# EAGLE schematic 6matrix (EAGLE 9.3.1)

## Sheet 1 of 3
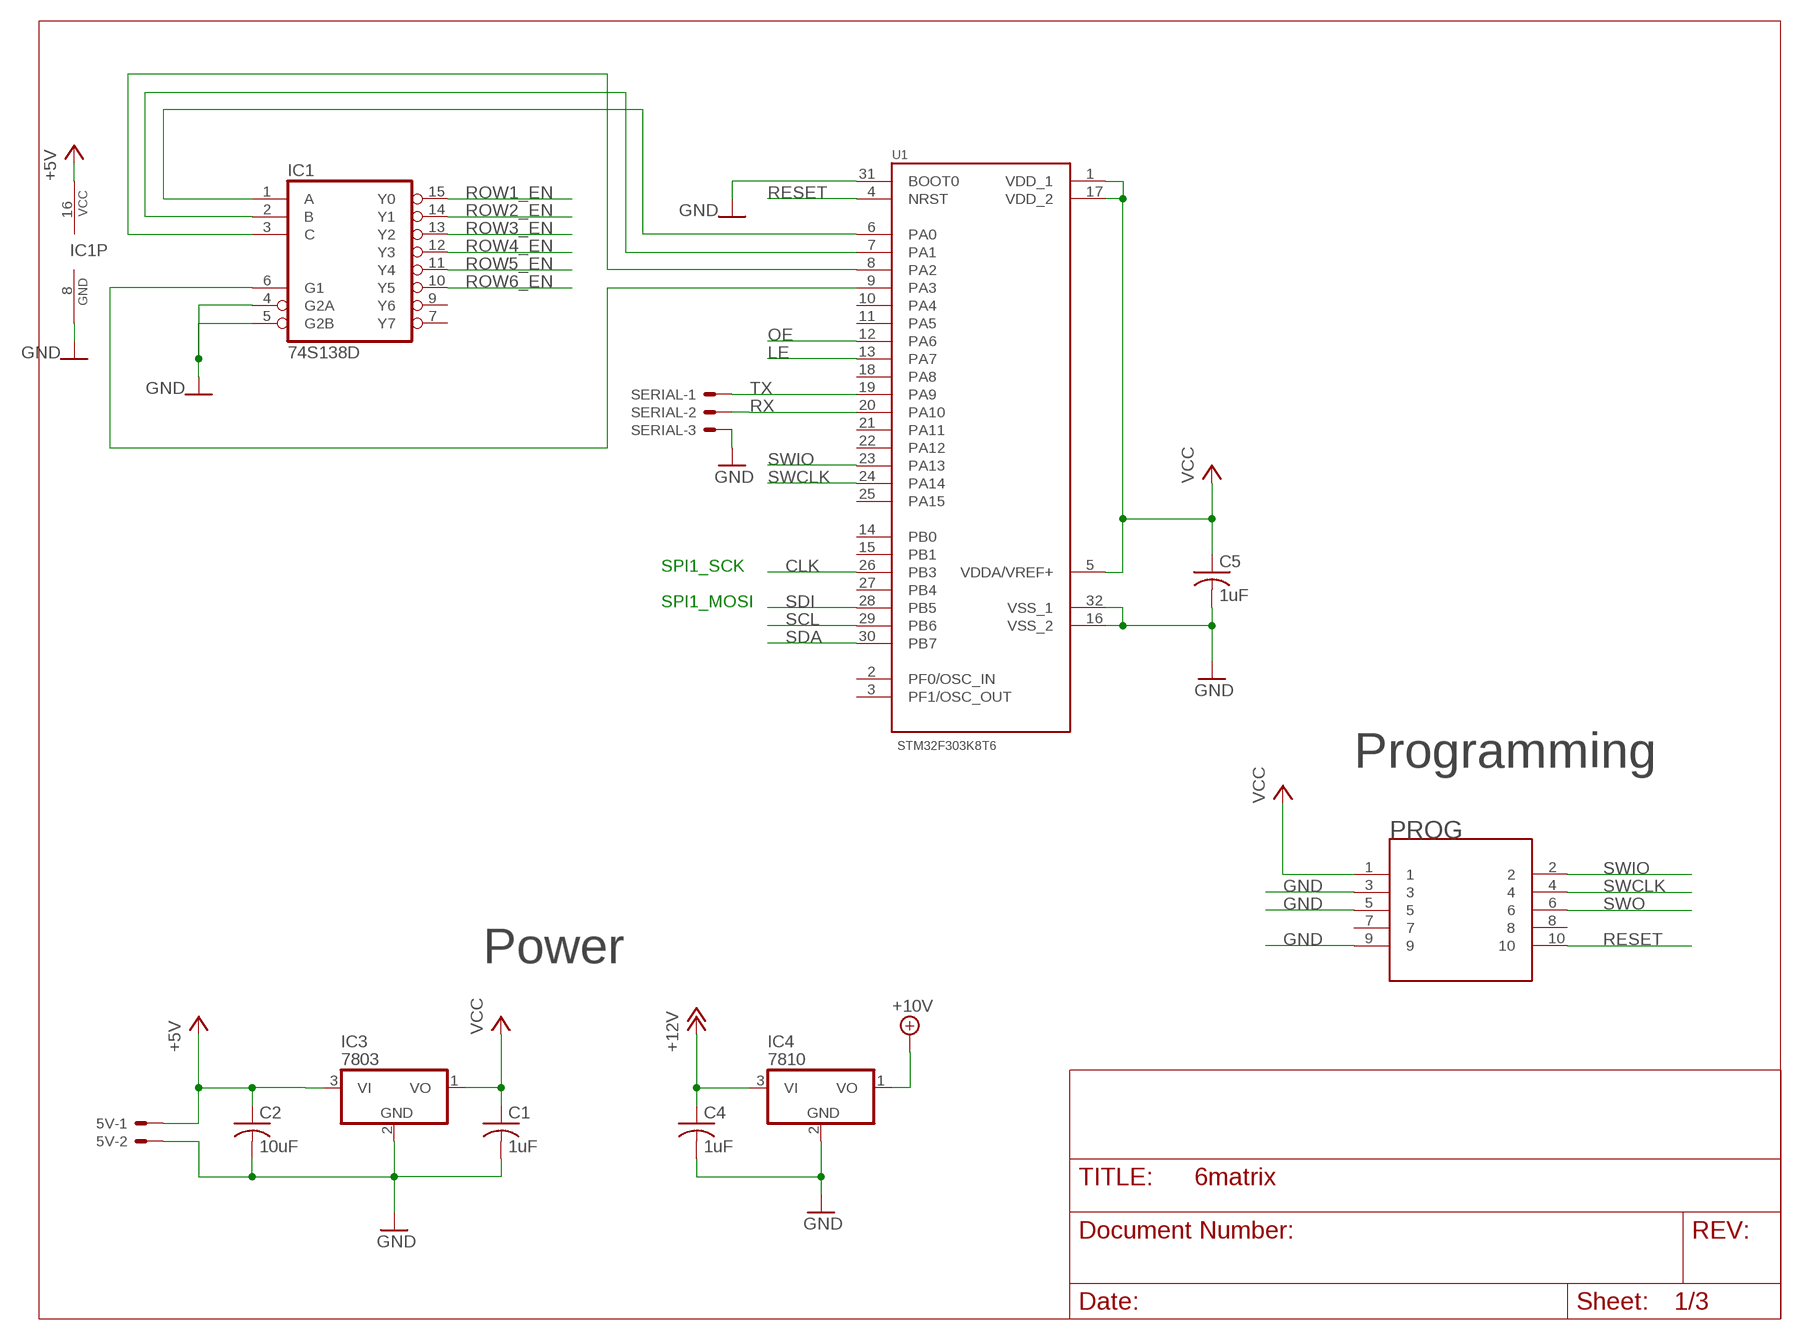
[diagram p0: schematic, sheet 1]

### Parts
5V  22-23-2021  [22-23-2021]
C1  1uF  C-US025-025X050  [C025-025X050]
C2  10uF  C-US025-025X050  [C025-025X050]
C4  1uF  C-US025-025X050  [C025-025X050]
C5  1uF  C-USC0805  [C0805]
IC1  74S138D  [SO16]
IC3  7803  78L05Z  [TO92]
IC4  7810  78L05Z  [TO92]
PROG  CORTEX_HEADERJ  [CORTEX_HEADER]
SERIAL  22-23-2031  [22-23-2031]
U1  STM32F303K8T6  [QFP80P900X900X160-32N]

### Nets
+5V [power]: 5V.1 C2.1 IC1.16(VCC) IC3.3(VI) ; also sheet 2
+10V [power]: IC4.1(VO) ; also sheet 3
+12V [power]: C4.1 IC4.3(VI) ; also sheet 3
CLK: U1.26(PB3) ; also sheet 2
GND [power]: 5V.2 C1.2 C2.2 C4.2 C5.2 IC1.4(G2A) IC1.5(G2B) IC1.8(GND) IC3.2(GND) IC4.2(GND) PROG.3 PROG.5 PROG.9 SERIAL.3 U1.16(VSS_2) U1.31(BOOT0) U1.32(VSS_1) ; also sheet 2,3
LE: U1.13(PA7) ; also sheet 2
N$7: IC1.1(A) U1.6(PA0)
N$10: IC1.2(B) U1.7(PA1)
N$12: IC1.3(C) U1.8(PA2)
N$14: IC1.6(G1) U1.9(PA3)
OE: U1.12(PA6) ; also sheet 2
RESET: PROG.10 U1.4(NRST)
ROW1_EN: IC1.15(Y0) ; also sheet 2
ROW2_EN: IC1.14(Y1) ; also sheet 2
ROW3_EN: IC1.13(Y2) ; also sheet 2
ROW4_EN: IC1.12(Y3) ; also sheet 2
ROW5_EN: IC1.11(Y4) ; also sheet 2
ROW6_EN: IC1.10(Y5) ; also sheet 2
RX: SERIAL.2 U1.20(PA10)
SCL: U1.29(PB6) ; also sheet 3
SDA: U1.30(PB7) ; also sheet 3
SDI: U1.28(PB5) ; also sheet 2
SWCLK: PROG.4 U1.24(PA14)
SWIO: PROG.2 U1.23(PA13)
SWO: PROG.6
TX: SERIAL.1 U1.19(PA9)
VCC [power]: C1.1 C5.1 IC3.1(VO) PROG.1 U1.1(VDD_1) U1.5(VDDA/VREF+) U1.17(VDD_2) ; also sheet 2,3
Unconnected: IC1.7(Y7) IC1.9(Y6) PROG.7 PROG.8 U1.2(PF0/OSC_IN) U1.3(PF1/OSC_OUT) U1.10(PA4) U1.11(PA5) U1.14(PB0) U1.15(PB1) U1.18(PA8) U1.21(PA11) U1.22(PA12) U1.25(PA15) U1.27(PB4)

### Notes on the sheet
- SPI1_SCK
- SPI1_MOSI
- Programming
- Power

## Sheet 2 of 3
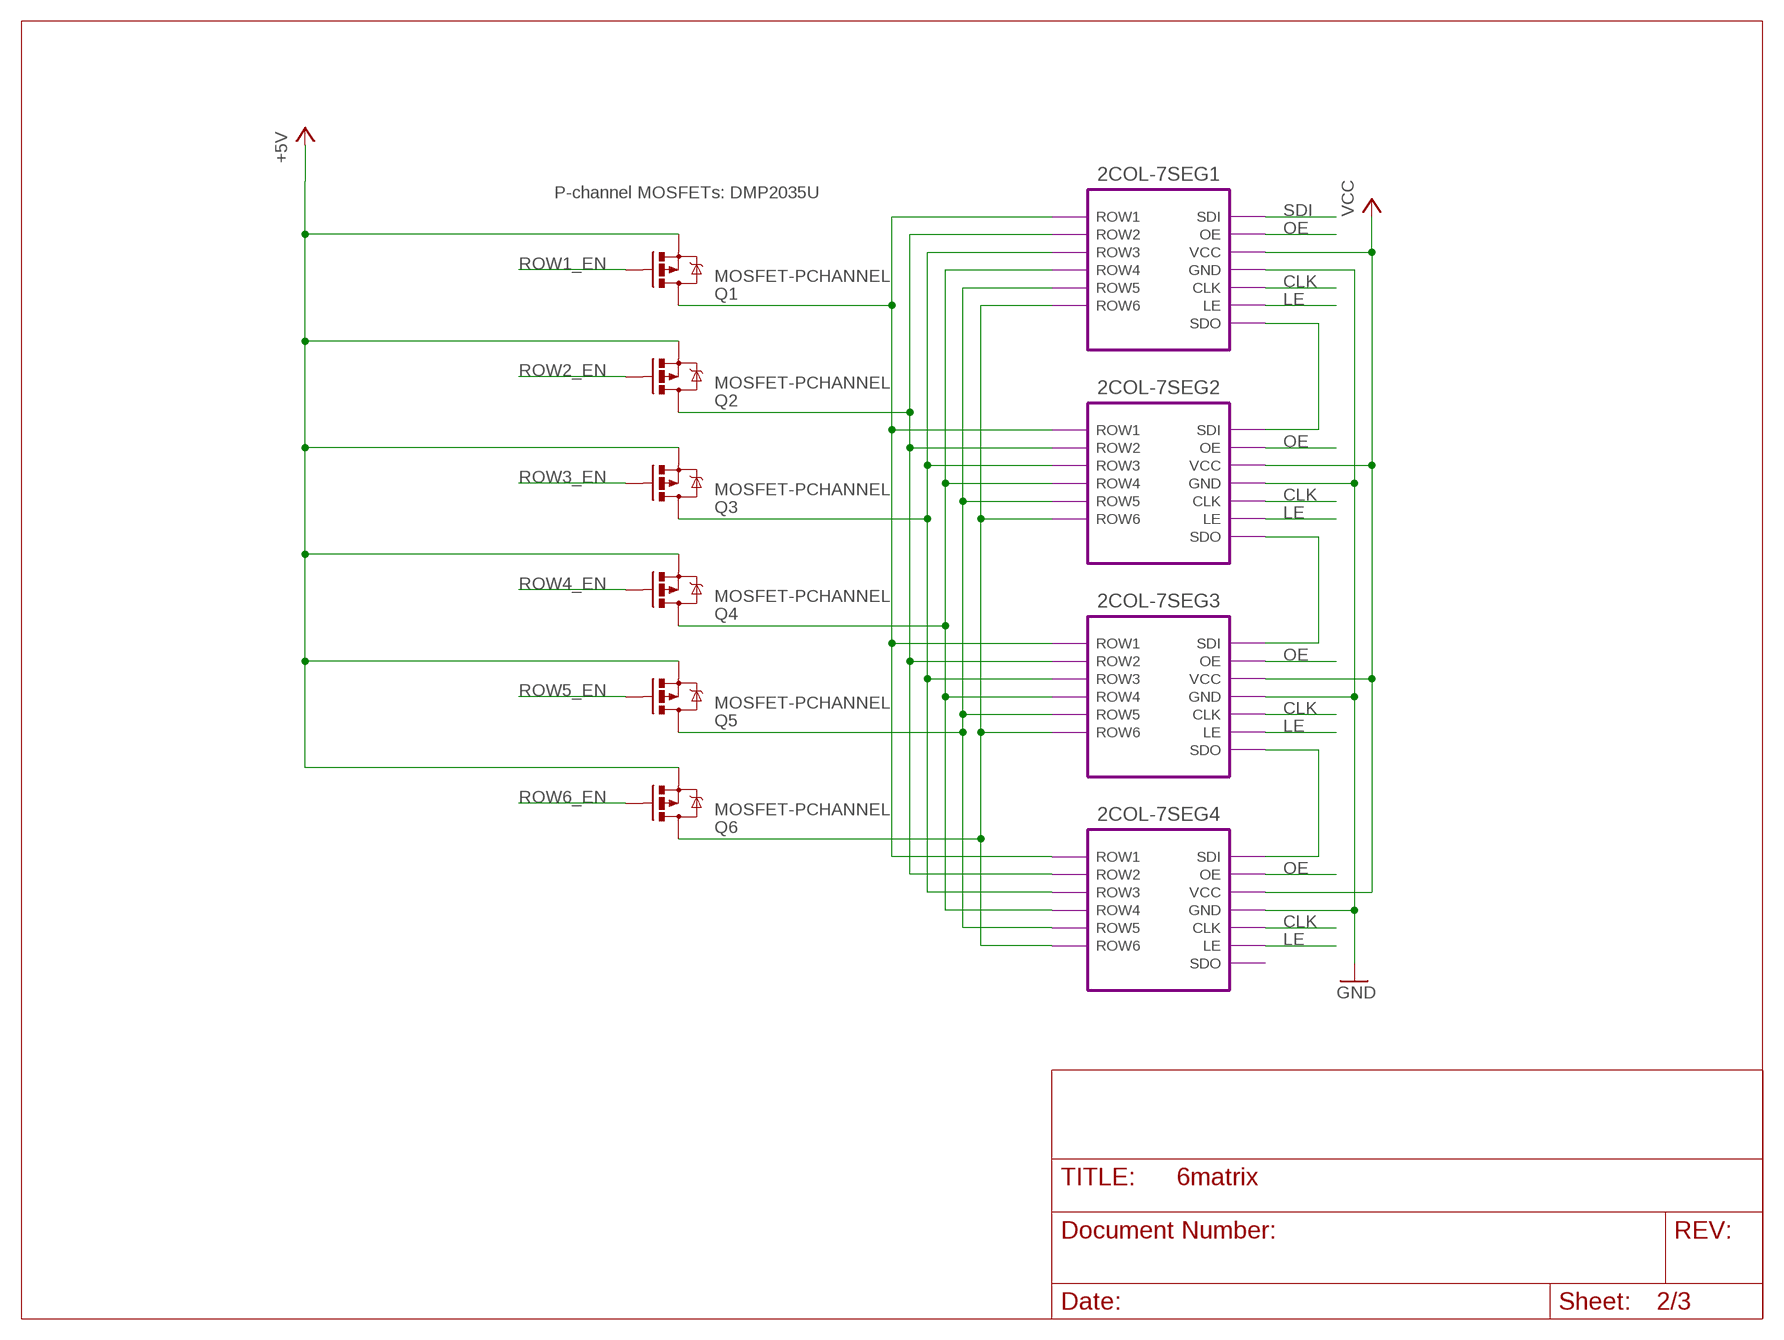
[diagram p1: schematic, sheet 2]

### Parts
Q1  MOSFET-PCHANNEL  [SOT23]
Q2  MOSFET-PCHANNEL  [SOT23]
Q3  MOSFET-PCHANNEL  [SOT23]
Q4  MOSFET-PCHANNEL  [SOT23]
Q5  MOSFET-PCHANNEL  [SOT23]
Q6  MOSFET-PCHANNEL  [SOT23]

### Module instances
2COL-7SEG1 = 2COL-7SEG
2COL-7SEG2 = 2COL-7SEG
2COL-7SEG3 = 2COL-7SEG
2COL-7SEG4 = 2COL-7SEG

### Nets
+5V [power]: Q1.2(S) Q2.2(S) Q3.2(S) Q4.2(S) Q5.2(S) Q6.2(S) ; also sheet 1
CLK: port 2COL-7SEG2.CLK 2COL-7SEG1.CLK 2COL-7SEG3.CLK 2COL-7SEG4.CLK ; also sheet 1
GND [power]: port 2COL-7SEG1.GND 2COL-7SEG4.GND 2COL-7SEG2.GND 2COL-7SEG3.GND ; also sheet 1,3
LE: port 2COL-7SEG4.LE 2COL-7SEG2.LE 2COL-7SEG1.LE 2COL-7SEG3.LE ; also sheet 1
N$1: Q6.3(D) ; port 2COL-7SEG4.ROW6 2COL-7SEG3.ROW6 2COL-7SEG2.ROW6 2COL-7SEG1.ROW6
N$2: Q5.3(D) ; port 2COL-7SEG4.ROW5 2COL-7SEG3.ROW5 2COL-7SEG2.ROW5 2COL-7SEG1.ROW5
N$3: Q4.3(D) ; port 2COL-7SEG4.ROW4 2COL-7SEG3.ROW4 2COL-7SEG2.ROW4 2COL-7SEG1.ROW4
N$4: Q3.3(D) ; port 2COL-7SEG4.ROW3 2COL-7SEG3.ROW3 2COL-7SEG2.ROW3 2COL-7SEG1.ROW3
N$5: Q2.3(D) ; port 2COL-7SEG4.ROW2 2COL-7SEG3.ROW2 2COL-7SEG2.ROW2 2COL-7SEG1.ROW2
N$6: Q1.3(D) ; port 2COL-7SEG4.ROW1 2COL-7SEG3.ROW1 2COL-7SEG2.ROW1 2COL-7SEG1.ROW1
N$8: port 2COL-7SEG1.SDO 2COL-7SEG2.SDI
N$9: port 2COL-7SEG2.SDO 2COL-7SEG3.SDI
N$11: port 2COL-7SEG3.SDO 2COL-7SEG4.SDI
OE: port 2COL-7SEG2.OE 2COL-7SEG1.OE 2COL-7SEG3.OE 2COL-7SEG4.OE ; also sheet 1
ROW1_EN: Q1.1(G) ; also sheet 1
ROW2_EN: Q2.1(G) ; also sheet 1
ROW3_EN: Q3.1(G) ; also sheet 1
ROW4_EN: Q4.1(G) ; also sheet 1
ROW5_EN: Q5.1(G) ; also sheet 1
ROW6_EN: Q6.1(G) ; also sheet 1
SDI: port 2COL-7SEG1.SDI ; also sheet 1
VCC [power]: port 2COL-7SEG1.VCC 2COL-7SEG4.VCC 2COL-7SEG2.VCC 2COL-7SEG3.VCC ; also sheet 1,3

### Notes on the sheet
- P-channel MOSFETs: DMP2035U

## Sheet 3 of 3
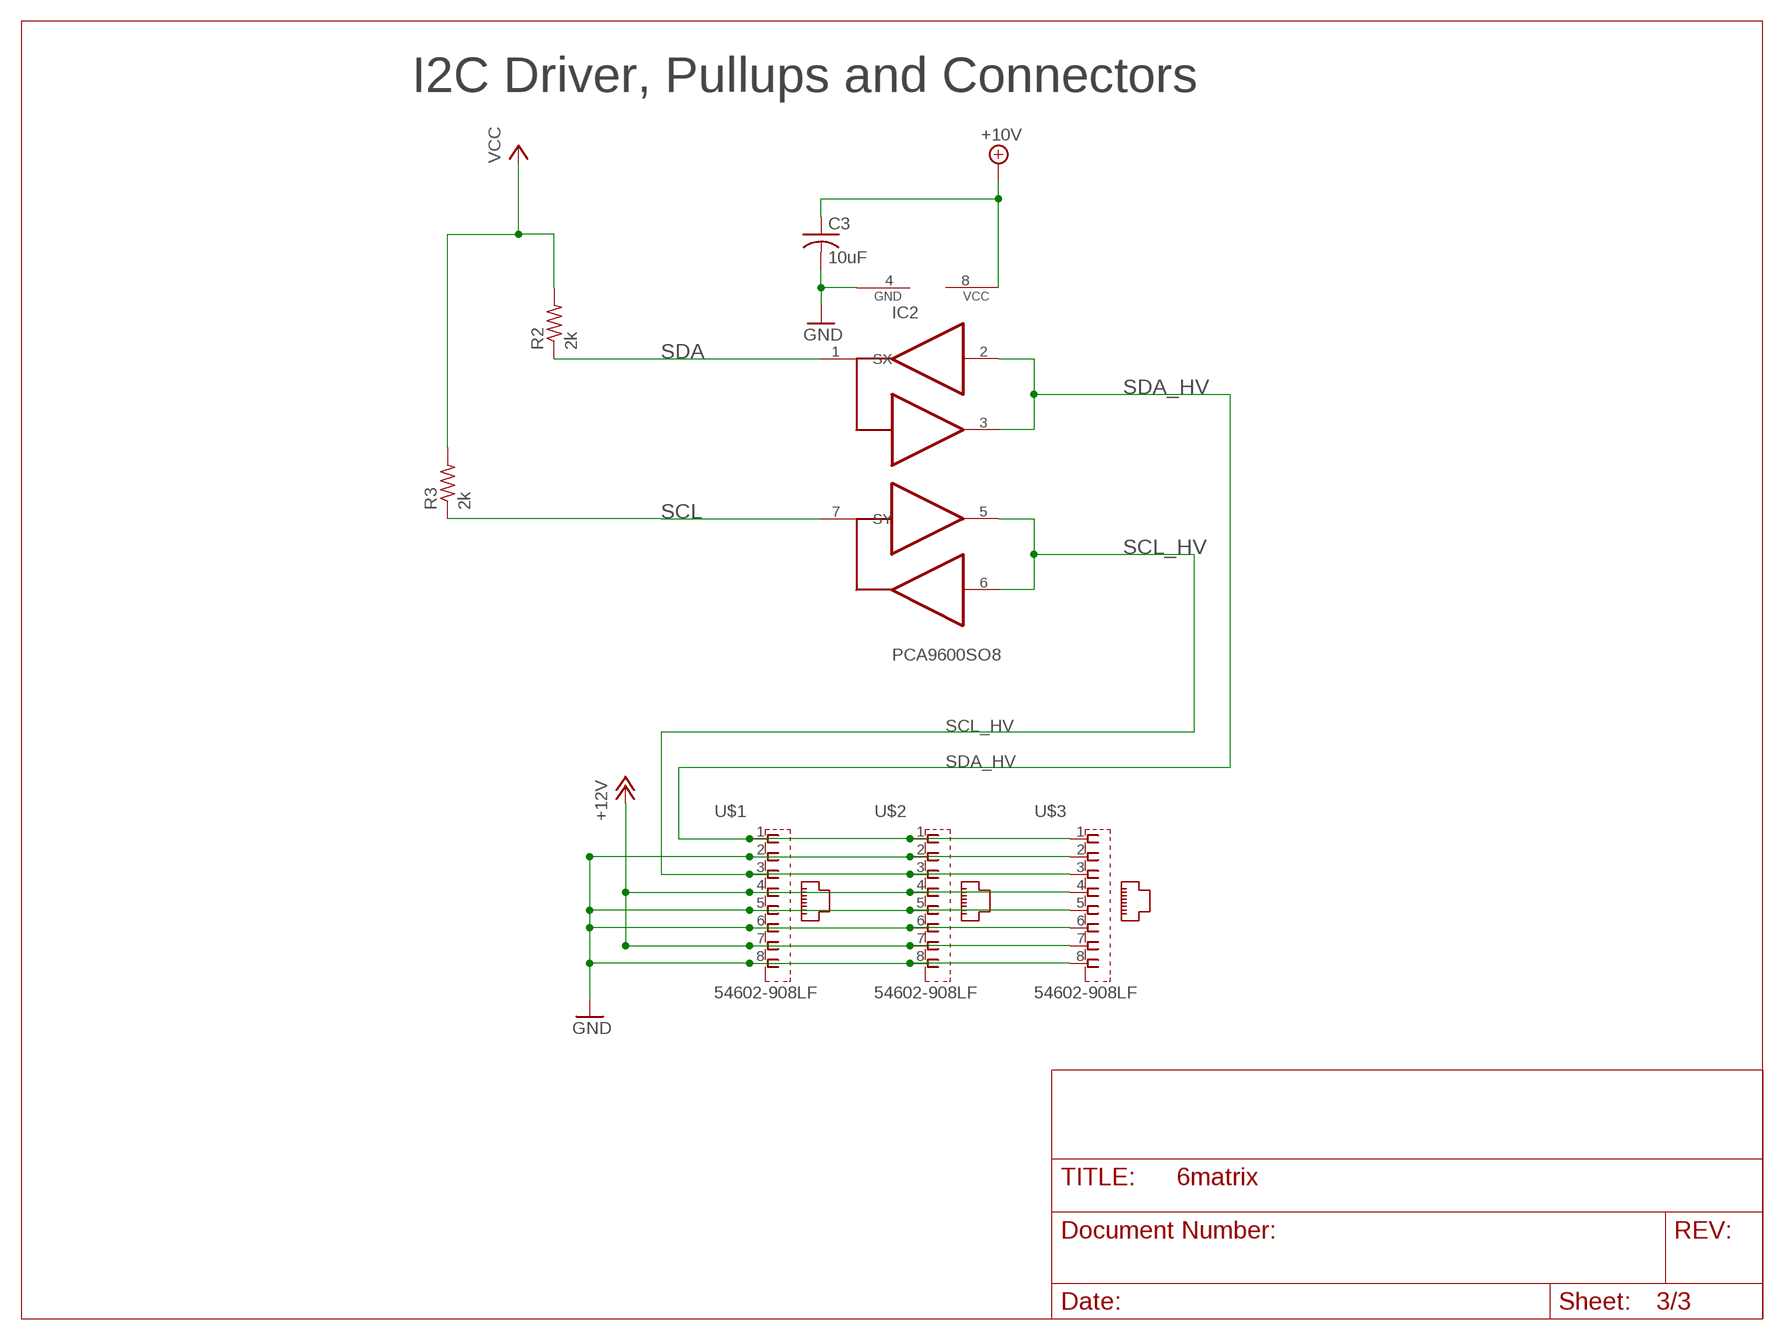
[diagram p2: schematic, sheet 3]

### Parts
C3  10uF  C-US025-025X050  [C025-025X050]
IC2  PCA9600SO8  [SO08]
R2  2k  R-US_0204/5  [0204/5]
R3  2k  R-US_0204/5  [0204/5]
U$1  54602-908LF  [AMPHENOL_54602-908LF]
U$2  54602-908LF  [AMPHENOL_54602-908LF]
U$3  54602-908LF  [AMPHENOL_54602-908LF]

### Nets
+10V [power]: C3.1 IC2.8(VCC) ; also sheet 1
+12V [power]: U$1.4 U$1.7 U$2.4 U$2.7 U$3.4 U$3.7 ; also sheet 1
GND [power]: C3.2 IC2.4(GND) U$1.2 U$1.5 U$1.6 U$1.8 U$2.2 U$2.5 U$2.6 U$2.8 U$3.2 U$3.5 U$3.6 U$3.8 ; also sheet 1,2
SCL: IC2.7(SY) R3.1 ; also sheet 1
SCL_HV: IC2.5(TY) IC2.6(RY) U$1.3 U$2.3 U$3.3
SDA: IC2.1(SX) R2.1 ; also sheet 1
SDA_HV: IC2.2(RX) IC2.3(TX) U$1.1 U$2.1 U$3.1
VCC [power]: R2.2 R3.2 ; also sheet 1,2

### Notes on the sheet
- I2C Driver, Pullups and Connectors

## Library data of the parts
5V = con-molex:22-23-2021: .100" (2.54mm) Center Header - 2 Pin; MF: MOLEX; MPN: 22-23-2021; OC_FARNELL: 1462926; OC_NEWARK: 25C3832
C1-C5 = rcl:C-US: CAPACITOR, American symbol; SPICEPREFIX: C
IC1 = 74xx-us:74*138: 3-line to 8-line DECODER/DEMULTIPLEXER
IC2 = 4534_I2C2:PCA9600: I2C ACTIVE TERMINATOR SO-8
IC3 IC4 = linear:78*: Positive VOLTAGE REGULATOR Source: http://cache.national.com/ds/LM/LM78L05.pdf http://www.fairchildsemi.com/ds/LM/LM7805.pdf
PROG = Lectrobox:CORTEX_HEADER; AVAILABILITY: Unavailable; DESCRIPTION: Conn Shrouded Header HDR 10 POS 1.27mm Solder ST Thru-Hole Tube; MF: Samtec Inc.; MP: TFM-105-01-S-D-WT; PACKAGE: None; PRICE: None
Q1-Q6 = SparkFun:MOSFET-PCHANNEL
R2 R3 = rcl:R-US_: RESISTOR, American symbol; SPICEPREFIX: R
SERIAL = con-molex:22-23-2031: .100" (2.54mm) Center Header - 3 Pin; MF: MOLEX; MPN: 22-23-2031; OC_FARNELL: 1462950; OC_NEWARK: 30C0862
U1 = STM32F303K8T6:STM32F303K8T6: Analog and DSP with FPU ARM Cortex-M4 MCU with 64 Kbytes Flash, 72 MHz CPU, CCM, 12-bit ADC 5 MSPS, comparators, op-amp; AVAILABILITY: Unavailable; DESCRIPTION: Analog and DSP with FPU ARM Cortex-M4 MCU with 64 Kbytes Flash, 72 MHz CPU, CCM, 12-bit ADC 5 MSPS, comparators, op-amp; MF: STMicroelectronics; MP: STM32F303K8T6; PACKAGE: LQFP-32 STMicroelectronics; PRICE: None
U$1-U$3 = 54602-908LF:54602-908LF: CONN MOD JACK 8P8C R/A UNSHLD; DESCRIPTION: Cat3 Rj45 Modular Jack, 8 Position, 1 Port; DIGI-KEY_PART_NUMBER: 609-1046-ND; DIGI-KEY_PURCHASE_URL: https://www.digikey.com/product-detail/en/amphenol-icc-fci/54602-908LF/609-1046-ND/1001360?utm_source=snapeda&utm_medium=aggregator&utm_campaign=symbol; MF: Amphenol ICC; MP: 54602-908LF; PACKAGE: None

## Module 2COL-7SEG
Ports: ROW1(in) ROW2(in) ROW3(in) ROW4(in) ROW5(in) ROW6(in) SDI(io) SDO(io) VCC(io) GND(io) CLK(io) LE(io) OE(io)
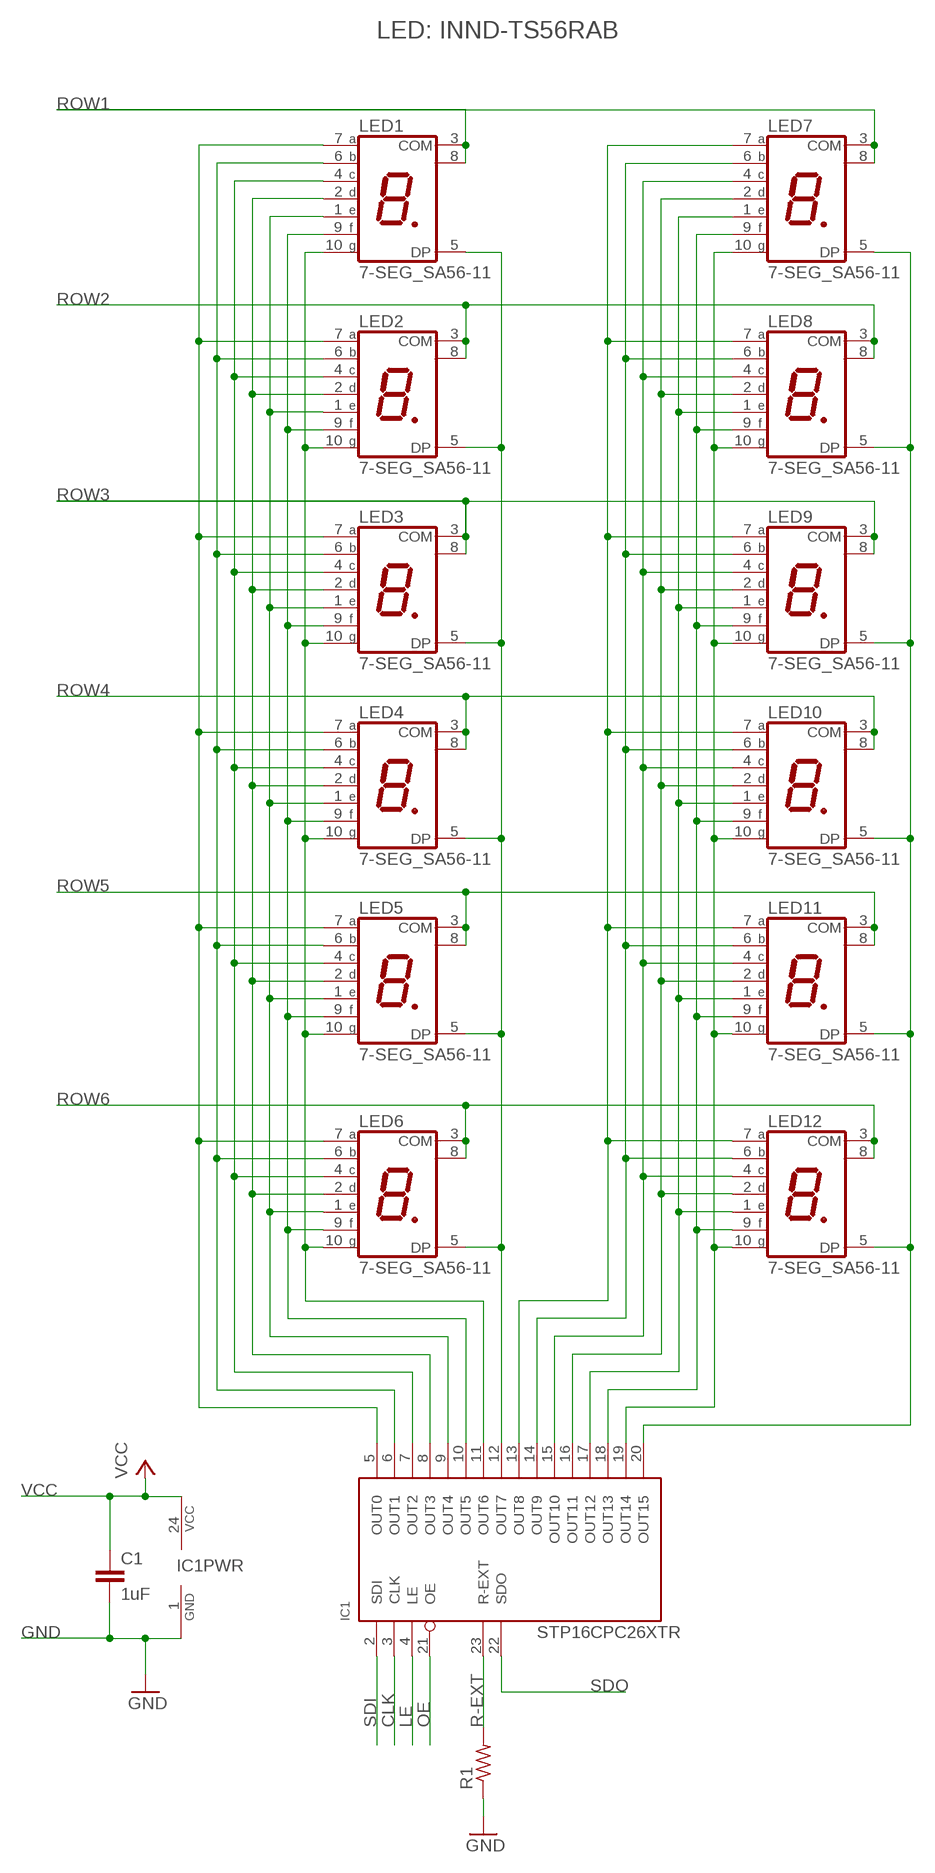
[diagram p3: schematic, module 2COL-7SEG, sheet 1]

### Parts
C1  1uF  C-EUC1206  [C1206]
IC1  STP16CPC26XTR  ALLEGRO-A6282TSSOP24  [SOP65P640X120-24]
LED1  7-SEG_SA56-11  [SA56-11]
LED2  7-SEG_SA56-11  [SA56-11]
LED3  7-SEG_SA56-11  [SA56-11]
LED4  7-SEG_SA56-11  [SA56-11]
LED5  7-SEG_SA56-11  [SA56-11]
LED6  7-SEG_SA56-11  [SA56-11]
LED7  7-SEG_SA56-11  [SA56-11]
LED8  7-SEG_SA56-11  [SA56-11]
LED9  7-SEG_SA56-11  [SA56-11]
LED10  7-SEG_SA56-11  [SA56-11]
LED11  7-SEG_SA56-11  [SA56-11]
LED12  7-SEG_SA56-11  [SA56-11]
R1  R-US_R0603  [R0603]

### Nets
CLK: IC1.3(CLK)
GND: C1.2 IC1.1(GND) R1.1
LE: IC1.4(LE)
N$1: IC1.11(OUT6) LED1.10(G) LED2.10(G) LED3.10(G) LED4.10(G) LED5.10(G) LED6.10(G)
N$2: IC1.12(OUT7) LED1.5(DP) LED2.5(DP) LED3.5(DP) LED4.5(DP) LED5.5(DP) LED6.5(DP)
N$3: IC1.19(OUT14) LED7.10(G) LED8.10(G) LED9.10(G) LED10.10(G) LED11.10(G) LED12.10(G)
N$4: IC1.18(OUT13) LED7.9(F) LED8.9(F) LED9.9(F) LED10.9(F) LED11.9(F) LED12.9(F)
N$5: IC1.17(OUT12) LED7.1(E) LED8.1(E) LED9.1(E) LED10.1(E) LED11.1(E) LED12.1(E)
N$6: IC1.5(OUT0) LED1.7(A) LED2.7(A) LED3.7(A) LED4.7(A) LED5.7(A) LED6.7(A)
N$7: IC1.6(OUT1) LED1.6(B) LED2.6(B) LED3.6(B) LED4.6(B) LED5.6(B) LED6.6(B)
N$8: IC1.10(OUT5) LED1.9(F) LED2.9(F) LED3.9(F) LED4.9(F) LED5.9(F) LED6.9(F)
N$9: IC1.9(OUT4) LED1.1(E) LED2.1(E) LED3.1(E) LED4.1(E) LED5.1(E) LED6.1(E)
N$10: IC1.8(OUT3) LED1.2(D) LED2.2(D) LED3.2(D) LED4.2(D) LED5.2(D) LED6.2(D)
N$11: IC1.7(OUT2) LED1.4(C) LED2.4(C) LED3.4(C) LED4.4(C) LED5.4(C) LED6.4(C)
N$12: IC1.16(OUT11) LED7.2(D) LED8.2(D) LED9.2(D) LED10.2(D) LED11.2(D) LED12.2(D)
N$13: IC1.15(OUT10) LED7.4(C) LED8.4(C) LED9.4(C) LED10.4(C) LED11.4(C) LED12.4(C)
N$14: IC1.14(OUT9) LED7.6(B) LED8.6(B) LED9.6(B) LED10.6(B) LED11.6(B) LED12.6(B)
N$15: IC1.13(OUT8) LED7.7(A) LED8.7(A) LED9.7(A) LED10.7(A) LED11.7(A) LED12.7(A)
N$16: IC1.20(OUT15) LED7.5(DP) LED8.5(DP) LED9.5(DP) LED10.5(DP) LED11.5(DP) LED12.5(DP)
OE: IC1.21(OE)
R-EXT: IC1.23(R-EXT) R1.2
ROW1: LED1.3(COM) LED1.8(COM) LED7.3(COM) LED7.8(COM)
ROW2: LED2.3(COM) LED2.8(COM) LED8.3(COM) LED8.8(COM)
ROW3: LED3.3(COM) LED3.8(COM) LED9.3(COM) LED9.8(COM)
ROW4: LED4.3(COM) LED4.8(COM) LED10.3(COM) LED10.8(COM)
ROW5: LED5.3(COM) LED5.8(COM) LED11.3(COM) LED11.8(COM)
ROW6: LED6.3(COM) LED6.8(COM) LED12.3(COM) LED12.8(COM)
SDI: IC1.2(SDI)
SDO: IC1.22(SDO)
VCC: C1.1 IC1.24(VCC)

### Notes on the sheet
- LED: INND-TS56RAB
- STP16CPC26XTR

### Library data of the parts
C1 = rcl:C-EU: CAPACITOR, European symbol; SPICEPREFIX: C
IC1 = Lectrobox:ALLEGRO-A6282: Allegro A6282 16-output LED Driver, TSSOP-24
LED1-LED12 = display-kingbright:7-SEG_: Kingbright 14.2mm (0.56 INCH) SINGLE DIGIT NUMERIC DUISPLAY Source: SA56-11EWA(Ver1189471036.pdf; OC_FARNELL: unknown; OC_NEWARK: unknown
R1 = rcl:R-US_: RESISTOR, American symbol; SPICEPREFIX: R

## Net classes
0 default: width 0.152 mm, drill 0.152 mm, clearance 0.152 mm
1 power: width 0.508 mm, drill 0.305 mm, clearance 0.152 mm to class 0, clearance 0.152 mm